# Altium schematic sheet TCA9548A Solar Panel I2C Multiplexer.SchDoc
size Letter
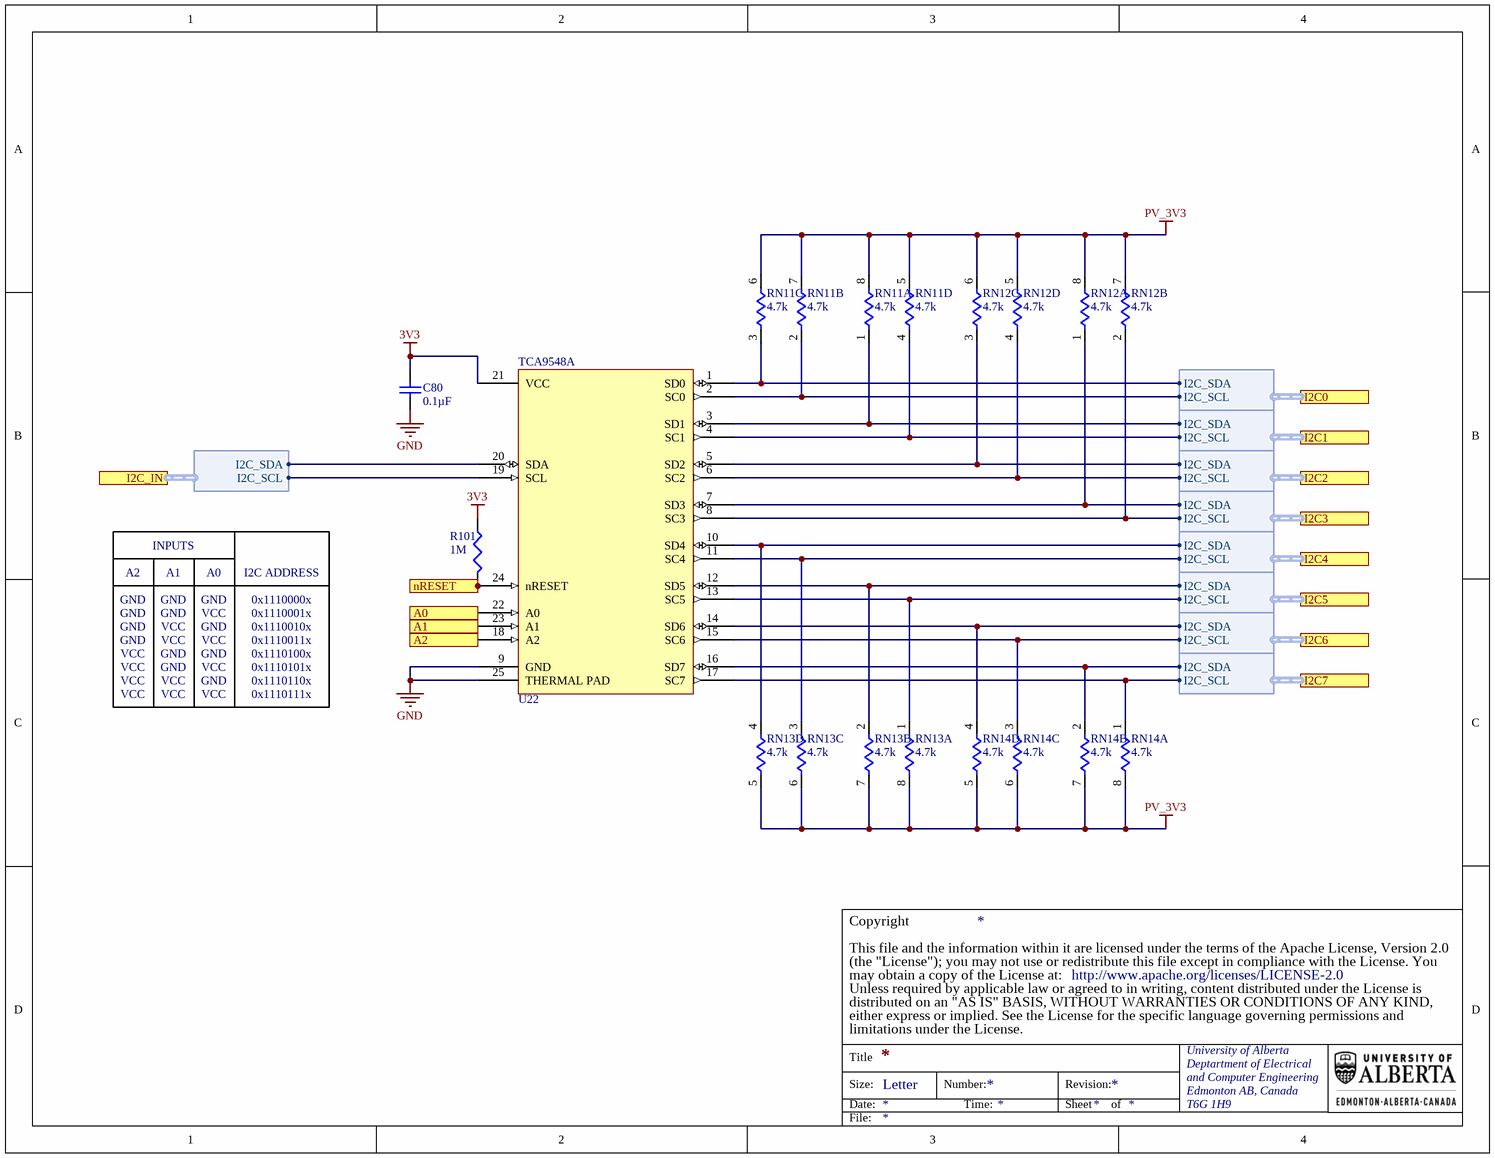
[diagram p0: TCA9548A Solar Panel I2C Multiplexer.SchDoc]

## Parts
C80  value 0.1µF  [TDK-CGA2B]  (hidden comment: Cap)
R101  value 1M  [PANA-ERJ2R]  (hidden comment: Res3)
RN11  value 4.7k  [PANA-EXB28V]  (hidden comment: Res4 Pack1)  (parts A,B,C,D of 4)
RN12  value 4.7k  [PANA-EXB28V]  (hidden comment: Res4 Pack1)  (parts A,B,C,D of 4)
RN13  value 4.7k  [PANA-EXB28V]  (hidden comment: Res4 Pack1)  (parts A,B,C,D of 4)
RN14  value 4.7k  [PANA-EXB28V]  (hidden comment: Res4 Pack1)  (parts A,B,C,D of 4)
U22  TCA9548A  [TI-RGE0024H]

## Ports
A0 (in), A1 (in), A2 (in), I2C0 (harness TCA9548A_I2C0), I2C1 (harness TCA9548A_I2C1), I2C2 (harness TCA9548A_I2C2), I2C3 (harness TCA9548A_I2C3), I2C4 (harness TCA9548A_I2C4), I2C5 (harness TCA9548A_I2C5), I2C6 (harness TCA9548A_I2C6), I2C7 (harness TCA9548A_I2C7), I2C_IN (harness TCA9548A_I2CIN), nRESET (in)

## Harnesses
TCA9548A_I2C1: I2C_SCL, I2C_SDA
TCA9548A_I2C2: I2C_SCL, I2C_SDA
TCA9548A_I2C3: I2C_SCL, I2C_SDA
TCA9548A_I2C4: I2C_SCL, I2C_SDA
TCA9548A_I2C5: I2C_SCL, I2C_SDA
TCA9548A_I2C6: I2C_SCL, I2C_SDA
TCA9548A_I2C7: I2C_SCL, I2C_SDA
TCA9548A_I2CIN: I2C_SCL, I2C_SDA
TCA9548A_I2C0: I2C_SCL, I2C_SDA

## Nets
3V3: C80.1 R101.2 U22.21(VCC)
GND: C80.2 U22.9(GND) U22.25(THERMAL_PAD)
PV_3V3: RN11.5 RN11.6 RN11.7 RN11.8 RN12.5 RN12.6 RN12.7 RN12.8 RN13.5 RN13.6 RN13.7 RN13.8 RN14.5 RN14.6 RN14.7 RN14.8
A0: U22.22(A0) ; port A0
A1: U22.23(A1) ; port A1
A2: U22.18(A2) ; port A2
nRESET: R101.1 U22.24(nRESET) ; port nRESET
NetRN11_1: RN11.1 U22.3(SD1) ; port I2C1.I2C_SDA
NetRN11_2: RN11.2 U22.2(SC0) ; port I2C0.I2C_SCL
NetRN11_3: RN11.3 U22.1(SD0) ; port I2C0.I2C_SDA
NetRN11_4: RN11.4 U22.4(SC1) ; port I2C1.I2C_SCL
NetRN12_1: RN12.1 U22.7(SD3) ; port I2C3.I2C_SDA
NetRN12_2: RN12.2 U22.8(SC3) ; port I2C3.I2C_SCL
NetRN12_3: RN12.3 U22.5(SD2) ; port I2C2.I2C_SDA
NetRN12_4: RN12.4 U22.6(SC2) ; port I2C2.I2C_SCL
NetRN13_1: RN13.1 U22.13(SC5) ; port I2C5.I2C_SCL
NetRN13_2: RN13.2 U22.12(SD5) ; port I2C5.I2C_SDA
NetRN13_3: RN13.3 U22.11(SC4) ; port I2C4.I2C_SCL
NetRN13_4: RN13.4 U22.10(SD4) ; port I2C4.I2C_SDA
NetRN14_1: RN14.1 U22.17(SC7) ; port I2C7.I2C_SCL
NetRN14_2: RN14.2 U22.16(SD7) ; port I2C7.I2C_SDA
NetRN14_3: RN14.3 U22.15(SC6) ; port I2C6.I2C_SCL
NetRN14_4: RN14.4 U22.14(SD6) ; port I2C6.I2C_SDA
NetU22_19: U22.19(SCL) ; port I2C_IN.I2C_SCL
NetU22_20: U22.20(SDA) ; port I2C_IN.I2C_SDA

## Notes on the sheet
- A2
- INPUTS
- A1
- A0
- I2C ADDRESS
- GND
- VCC
- 0x1110000x
- 0x1110001x
- 0x1110010x
- 0x1110011x
- 0x1110100x
- 0x1110101x
- 0x1110110x
- 0x1110111x
- (the "License"); you may not use or redistribute this file except in compliance with the License. You
- This file and the information within it are licensed under the terms of the Apache License, Version 2.0
- Copyright
- Unless required by applicable law or agreed to in writing, content distributed under the License is
- distributed on an "AS IS" BASIS, WITHOUT WARRANTIES OR CONDITIONS OF ANY KIND,
- either express or implied. See the License for the specific language governing permissions and
- limitations under the License.
- may obtain a copy of the License at:
- http://www.apache.org/licenses/LICENSE-2.0
- Title
- Size:
- Date:
- Letter
- Number:
- Time:
- Revision:
- Sheet
- of
- University of Alberta
- Deptartment of Electrical
- and Computer Engineering
- Edmonton AB, Canada
- T6G 1H9
- File:

## Library data of the parts
C80 = PC-TDK-02259: CAP CER 0.1UF 50V X7R 0402; Manufacturer Part Number: CGA2B3X7R1H104K050BB; Index: 2259; Designator: C?; Tolerance: ±10%; Published: 2016-03-16; LatestRevisionDate: 2016-03-16; LatestRevisionNote: ...; PackageReference: 0402 (1005 Metric); Publisher: AlbertaSat; PackageDescription: Radial Cap, Thru-Hole; 2 Leads; 0.3 in Pin Spacing; Part Number: PC-TDK-02259; Supplier Part Number 1: 445-6899-1-ND; Supplier 1: Digi-key; Supplier Link: http://www.digikey.ca/product-search/en?keywords=445-6899-1-ND; Voltage - Rated: 50V; Temperature Coefficient: X7R; Applications: Automotive; Operating Temperature: -55°C ~ 125°C
R101 = 19704: RES SMD 1M OHM 1% 1/10W 0402; Part Number: 19704; Manufacturer Part Number: ERJ-2RKF1004X; Designator: R?; Power: 0.1W, 1/10W; Temperature Coefficient: ±100ppm/°C; Published: 8-Jun-2000; LatestRevisionDate: 29-May-2009; LatestRevisionNote: IPC-7351 Footprint Added.; PackageReference: 0402 (1005 Metric); Publisher: Altium Limited; PackageDescription: Chip Resistor, 2-Leads, Body 1.00x0.50mm, IPC Low Density; Supplier Part Number 1: P1.00MLCT-ND; Supplier 1: Digi-Key; Supplier Link: http://www.digikey.ca/product-search/en?keywords=P1.00MLCT-ND; Tolerance: ±1%; Operating Temperature: -55°C ~ 155°C
RN11-RN14 = 19961: RES ARRAY 4 RES 4.7K OHM 0804; Part Number: 19961; Manufacturer Part Number: EXB-28V472JX; Sim Note: Enter the Resistance value into parameter field.; Designator: RN?; Tolerance: ±5%; Power: 62.5mW; Temperature Coefficient: ±200ppm/°C; Code_JEDEC: MS-012-AC; Supplier Part Number 1: Y7472CT-ND; Supplier 1: Digi-Key; Supplier Link: http://www.digikey.ca/product-search/en?keywords=Y7472CT-ND; PackageReference: 0804, Convex, Long Side Terminals
U22 = 159: IC BUS SWITCH 1 X 8:1 24VQFN; Part Number: 159; Designator: U?; Supplier Part Number 2: 595-TCA9548ARGERQ1; Supplier 2: Mouser; Manufacturer Part Number: TCA9548ARGERQ1; Supplier Part Number 1: 296-TCA9548ARGERQ1CT-ND; Supplier 1: Digi-Key; Supplier Link: #https://www.digikey.ca/en/products/detail/texas-instruments/TCA9548ARGERQ1/10434845#; PackageReference: 24-VFQFN Exposed Pad; Operating Temperature: -40°C ~ 85°C (TA)